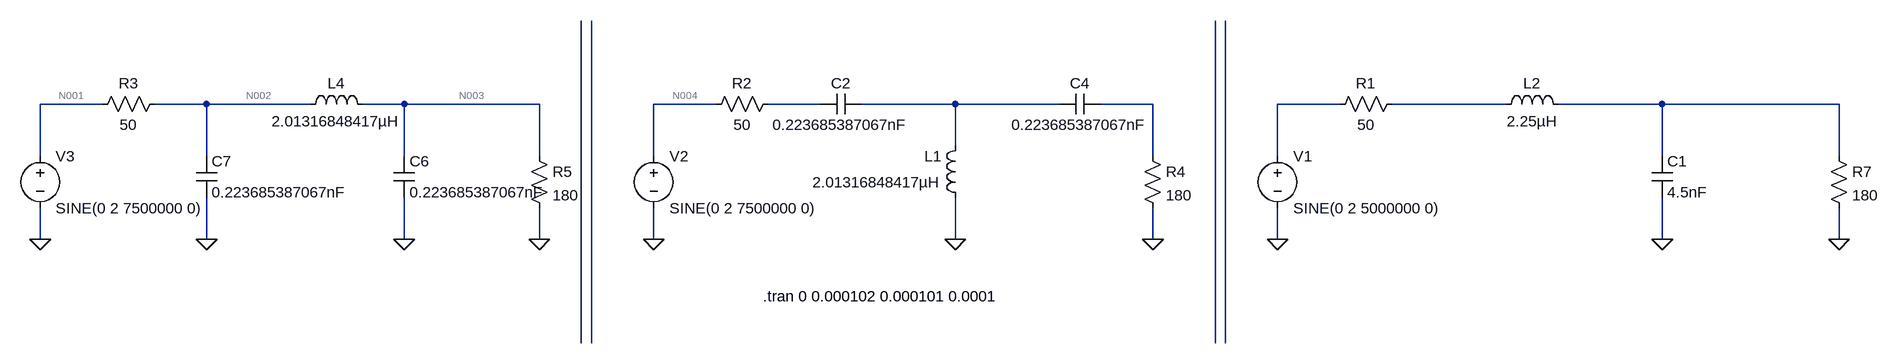
[diagram p0: schematic Circuit Theory Lab-4.asc]
Circuit Theory Lab-4.asc, the LTspice schematic file:
Version 4
SHEET 1 2688 680
WIRE -48 80 -144 80
WIRE 112 80 32 80
WIRE 272 80 112 80
WIRE 416 80 352 80
WIRE 624 80 416 80
WIRE 896 80 800 80
WIRE 1056 80 976 80
WIRE 1264 80 1120 80
WIRE 1424 80 1264 80
WIRE 1568 80 1488 80
WIRE 1856 80 1760 80
WIRE 2112 80 1936 80
WIRE 2352 80 2192 80
WIRE 2624 80 2352 80
WIRE 1264 144 1264 80
WIRE -144 160 -144 80
WIRE 112 160 112 80
WIRE 416 160 416 80
WIRE 624 160 624 80
WIRE 800 160 800 80
WIRE 1568 160 1568 80
WIRE 1760 160 1760 80
WIRE 2352 160 2352 80
WIRE 2624 160 2624 80
WIRE -144 288 -144 240
WIRE 112 288 112 224
WIRE 416 288 416 224
WIRE 624 288 624 240
WIRE 800 288 800 240
WIRE 1264 288 1264 224
WIRE 1568 288 1568 240
WIRE 1760 288 1760 240
WIRE 2352 288 2352 224
WIRE 2624 288 2624 240
WIRE 688 448 688 -48
WIRE 704 448 704 -48
WIRE 1664 448 1664 -48
WIRE 1680 448 1680 -48
FLAG 800 288 0
FLAG 1568 288 0
FLAG 1264 288 0
FLAG 1760 288 0
FLAG 2352 288 0
FLAG 2624 288 0
FLAG -144 288 0
FLAG 624 288 0
FLAG 112 288 0
FLAG 416 288 0
SYMBOL voltage 800 144 R0
WINDOW 123 0 0 Left 0
WINDOW 39 0 0 Left 0
SYMATTR InstName V2
SYMATTR Value SINE(0 2 7500000 0)
SYMBOL res 992 64 R90
WINDOW 0 0 56 VBottom 2
WINDOW 3 32 56 VTop 2
SYMATTR InstName R2
SYMATTR Value 50
SYMBOL cap 1056 96 R270
WINDOW 0 32 32 VTop 2
WINDOW 3 0 32 VBottom 2
SYMATTR InstName C2
SYMATTR Value 0.223685387067nF
SYMBOL res 1552 144 R0
SYMATTR InstName R4
SYMATTR Value 180
SYMBOL cap 1424 96 R270
WINDOW 0 32 32 VTop 2
WINDOW 3 0 32 VBottom 2
SYMATTR InstName C4
SYMATTR Value 0.223685387067nF
SYMBOL ind 1280 240 R180
WINDOW 0 36 80 Left 2
WINDOW 3 36 40 Left 2
SYMATTR InstName L1
SYMATTR Value 2.01316848417µH
SYMBOL voltage 1760 144 R0
WINDOW 123 0 0 Left 0
WINDOW 39 0 0 Left 0
SYMATTR InstName V1
SYMATTR Value SINE(0 2 5000000 0)
SYMBOL res 1952 64 R90
WINDOW 0 0 56 VBottom 2
WINDOW 3 32 56 VTop 2
SYMATTR InstName R1
SYMATTR Value 50
SYMBOL ind 2096 96 R270
WINDOW 0 32 56 VTop 2
WINDOW 3 5 56 VBottom 2
SYMATTR InstName L2
SYMATTR Value 2.25µH
SYMBOL cap 2336 160 R0
SYMATTR InstName C1
SYMATTR Value 4.5nF
SYMBOL res 2608 144 R0
SYMATTR InstName R7
SYMATTR Value 180
SYMBOL voltage -144 144 R0
WINDOW 123 0 0 Left 0
WINDOW 39 0 0 Left 0
SYMATTR InstName V3
SYMATTR Value SINE(0 2 7500000 0)
SYMBOL res 48 64 R90
WINDOW 0 0 56 VBottom 2
WINDOW 3 32 56 VTop 2
SYMATTR InstName R3
SYMATTR Value 50
SYMBOL res 608 144 R0
SYMATTR InstName R5
SYMATTR Value 180
SYMBOL cap 400 160 R0
SYMATTR InstName C6
SYMATTR Value 0.223685387067nF
SYMBOL cap 96 160 R0
SYMATTR InstName C7
SYMATTR Value 0.223685387067nF
SYMBOL ind 256 96 R270
WINDOW 0 32 56 VTop 2
WINDOW 3 5 56 VBottom 2
SYMATTR InstName L4
SYMATTR Value 2.01316848417µH
TEXT 968 376 Left 2 !.tran 0 0.000102 0.000101 0.0001

The netlist it stands for:
* Circuit Theory Lab-4.asc
V2 N004 0 SINE(0 2 7500000 0)
R2 N005 N004 50
C2 N005 N006 0.223685387067nF
R4 N007 0 180
C4 N006 N007 0.223685387067nF
L1 0 N006 2.01316848417µH
V1 N008 0 SINE(0 2 5000000 0)
R1 N009 N008 50
L2 N009 N010 2.25µH
C1 N010 0 4.5nF
R7 N010 0 180
V3 N001 0 SINE(0 2 7500000 0)
R3 N002 N001 50
R5 N003 0 180
C6 N003 0 0.223685387067nF
C7 N002 0 0.223685387067nF
L4 N002 N003 2.01316848417µH
.tran 0 0.000102 0.000101 0.0001
.backanno
.end

* Results of the author's LTspice run, read from the files saved beside the schematic
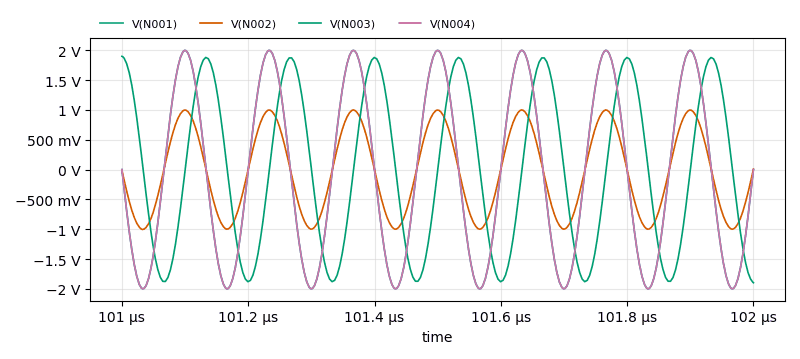
[diagram p1: Transient Analysis of Circuit Theory Lab-4.asc, plotted from the saved traces]
* Transient Analysis, 1 run:
*   V(N001): min -1.999 V, max 1.999 V, average -84.68 mV, rms 1.415 V, last 0 V
*   V(N002): min -1.004 V, max 999.8 mV, average -42.38 mV, rms 704.5 mV, last 3.67 mV
*   V(N003): min -1.897 V, max 1.9 V, average 938.1 µV, rms 1.33 V, last -1.897 V
*   V(N004): min -1.999 V, max 1.999 V, average -84.68 mV, rms 1.415 V, last 0 V